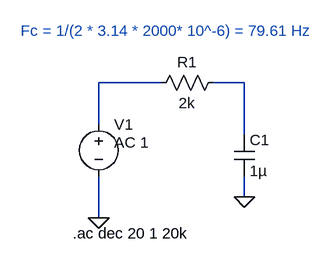
[diagram p0: schematic Filters - Passive RC Low Pass Filter - 1st order.asc]
Filters - Passive RC Low Pass Filter - 1st order.asc, the LTspice schematic file:
Version 4.1
SHEET 1 880 680
WIRE 192 80 96 80
WIRE 320 80 272 80
WIRE 96 144 96 80
WIRE 320 160 320 80
WIRE 320 256 320 224
WIRE 96 288 96 224
FLAG 96 288 0
FLAG 320 256 0
SYMBOL voltage 96 128 R0
WINDOW 3 24 44 Left 2
WINDOW 123 24 44 Left 2
WINDOW 39 0 0 Left 0
SYMATTR InstName V1
SYMATTR Value ""
SYMATTR Value2 AC 1
SYMBOL res 288 64 R90
WINDOW 0 0 56 VBottom 2
WINDOW 3 32 56 VTop 2
SYMATTR InstName R1
SYMATTR Value 2k
SYMBOL cap 304 160 R0
SYMATTR InstName C1
SYMATTR Value 1µ
TEXT 56 312 Left 2 !.ac dec 20 1 20k
TEXT -24 0 Left 2 ;Fc = 1/(2 * 3.14 * 2000* 10^-6) = 79.61 Hz

The netlist it stands for:
* Filters - Passive RC Low Pass Filter - 1st order.asc
V1 N001 0 AC 1
R1 N002 N001 2k
C1 N002 0 1µ
.ac dec 20 1 20k
* Fc = 1/(2 * 3.14 * 2000* 10^-6) = 79.61 Hz
.backanno
.end